# EAGLE schematic Joystick (EAGLE 8.2.2)
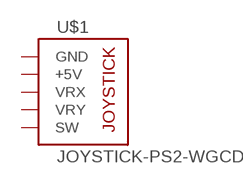
[diagram p0: schematic, sheet 1]

## Parts
U$1  JOYSTICK-PS2-WGCD  [JOYSTICK-PST-WGCD]
Unconnected: U$1.+5V U$1.GND U$1.SW U$1.VRX U$1.VRY

## Library data of the parts
U$1 = CMU-ArtFab:JOYSTICK-PS2-WGCD